# Altium schematic sheet Sheet1.SchDoc
size 420 x 297 mm; SheetNumber: 1; SheetTotal: 1
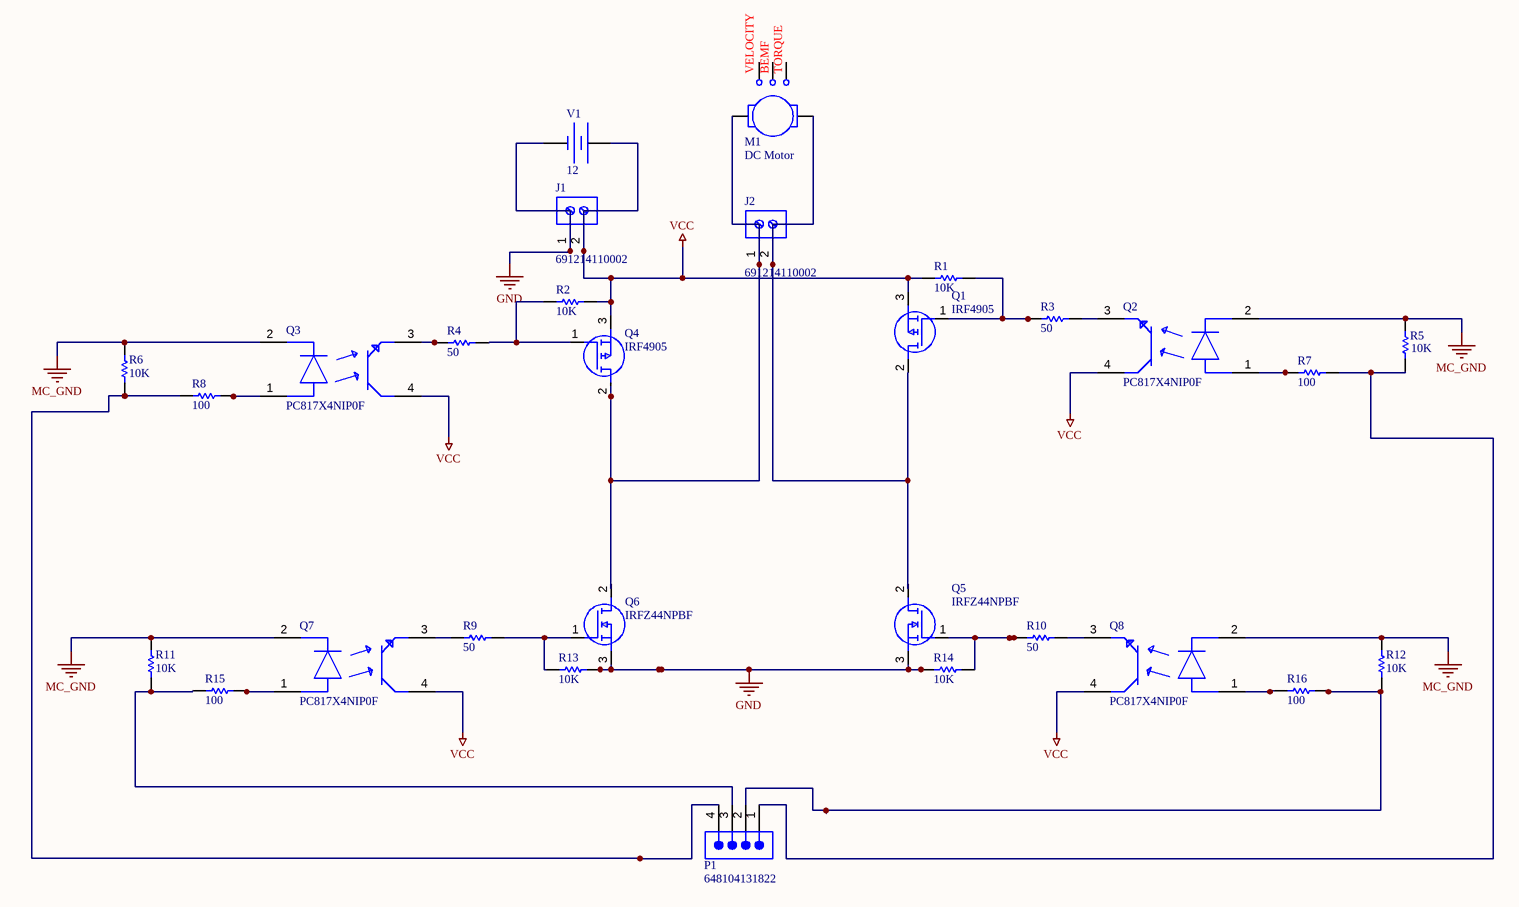
[diagram p0: Sheet1.SchDoc]

## Parts
J1  691214110002  [691214110002]
J2  691214110002  [691214110002]
M1  DC Motor
P1  648104131822  [648104131822]
Q1  IRF4905  [IRF4905_Footprint]
Q2  PC817X4NIP0F  [FP-PC817X4NIP0F-MFG]
Q3  PC817X4NIP0F  [FP-PC817X4NIP0F-MFG]
Q4  IRF4905  [IRF4905_Footprint]
Q5  IRFZ44NPBF  [IRFZ44NPBF_FOOTPRINT]
Q6  IRFZ44NPBF  [IRFZ44NPBF_FOOTPRINT]
Q7  PC817X4NIP0F  [FP-PC817X4NIP0F-MFG]
Q8  PC817X4NIP0F  [FP-PC817X4NIP0F-MFG]
R1  10K  [RESC3216X70X50NL05T20]
R2  10K  [RESC3216X70X50NL05T20]
R3  50  [RESC3216X70X50NL05T20]
R4  50  [RESC3216X70X50NL05T20]
R5  10K  [RESC3216X70X50NL05T20]
R6  10K  [RESC3216X70X50NL05T20]
R7  100  [RESC3216X70X50NL05T20]
R8  100  [RESC3216X70X50NL05T20]
R9  50  [RESC3216X70X50NL05T20]
R10  50  [RESC3216X70X50NL05T20]
R11  10K  [RESC3216X70X50NL05T20]
R12  10K  [RESC3216X70X50NL05T20]
R13  10K  [RESC3216X70X50NL05T20]
R14  10K  [RESC3216X70X50NL05T20]
R15  100  [RESC3216X70X50NL05T20]
R16  100  [RESC3216X70X50NL05T20]
V1  DC Magnitude: 12  (hidden comment: Constant Voltage Source)

## Nets
GND: J1.1 Q5.3(S) Q6.3(S) R13.1 R14.2 V1.2
MC_GND: Q2.2(C) Q3.2(C) Q7.2(C) Q8.2(C) R5.2 R6.2 R11.2 R12.2
VCC: J1.2 Q1.3(S) Q2.4(C) Q3.4(C) Q4.3(S) Q7.4(C) Q8.4(C) R1.2 R2.1 V1.1
NetJ2_1: J2.1 M1.1 Q4.2(D) Q6.2(D)
NetJ2_2: J2.2 M1.2 Q1.2(D) Q5.2(D)
NetP1_1: P1.1 R5.1 R7.2
NetP1_2: P1.2 R12.1 R16.2
NetP1_3: P1.3 R11.1 R15.1
NetP1_4: P1.4 R6.1 R8.1
NetQ1_1: Q1.1(G) R1.1 R3.1
NetQ2_1: Q2.1(A) R7.1
NetQ2_3: Q2.3(E) R3.2
NetQ3_1: Q3.1(A) R8.2
NetQ3_3: Q3.3(E) R4.1
NetQ4_1: Q4.1(G) R2.2 R4.2
NetQ5_1: Q5.1(G) R10.1 R14.1
NetQ6_1: Q6.1(G) R9.2 R13.2
NetQ7_1: Q7.1(A) R15.2
NetQ7_3: Q7.3(E) R9.1
NetQ8_1: Q8.1(A) R16.1
NetQ8_3: Q8.3(E) R10.2

Not connected (* = marked no-connect by the designer): M1 3 4 5

## Notes on the sheet
- THIS DOCUMENT AND THE DATA DISCLOSED HEREIN OR
- HEREWITH IS THE PROPERTY OF ALTIUM LIMITED AND MAY
- DWG NO:
- REVISION
- REV:
- DESCRIPTION
- DATE
- APPROVED
- BE FREELY DISTRIBUTED IN WHOLE. NO RIGHTS ARE
- RESERVED OR EXPRESS OR IMPLIED WARANTEE GIVEN.
- ENG:
- APPROVALS
- PROJECT
- DSN:
- CHK:
- REFERENCE DOCUMENTS
- PROJECT REVISION:
- TITLE
- DOCUMENT REVISION:
- DESIGN ITEM:
- BOM:
- FAB DWG:
- PCB DWG:
- ASSY DWG:
- SCALE:
- A3
- SIZE
- CAGE CODE
- FILE NAME
- DWG NO.
- SHEET
- OF
- REV
- (in symbol DC Motor) VELOCITY; BEMF; TORQUE

## Library data of the parts
J1 J2 = CMP-1502-02464-2: NexarPartId: 18818288; Plating: Brass, Steel; Current: 10A; Pitch: 3.5052mm; Number of Levels: 1; Number of Contacts: 2; Wire Gauge (Min): 16AWG; Voltage: 300V; Wire Gauge (Max): 24AWG; Stripping Length: -6mm; Number of Pins: 2; Number of Rows: 1; REACH SVHC: Unknown; RoHS: Compliant; Housing Material: Nylon; Termination: Screw; Mount: Through Hole; Contact Plating: Brass, Tin; Number of Positions Per Level: 2; Color: Blue, Green; Width: 7.9mm; Voltage Rating: 300V; Length: 7.4mm; Current Rating: 10A; Wire/Cable Gauge: 24AWG; Packaging: Box; Max Operating Temperature: 105°C; Lead Pitch: 3.5mm; Height: 8.7mm; Contact Material: Brass; Min Operating Temperature: -40°C
M1 = DC Motor: LA: 1.5M; RA: 0.5; KE: 0.05; JM: 250U; BM: 0.1M; TL: 0; SimulationGenericComponent: True; KT: 0.05
P1 = CMP-1502-00732-2: NexarPartId: 18818253; Gender: Male; Current Rating: 1A; Connector Type: Male Pin; Voltage Rating: 50V; Contact Resistance: 20mΩ; Pitch: 1.5mm; Number of Contacts: 4; Insulation Resistance: 500MΩ; Insulation: Insulated; Min Operating Temperature: -25°C; Max Operating Temperature: 85°C; Contact Plating: Tin; Lead Pitch: 1.5mm; Length: 9mm; Termination: SMD/SMT; Height: 3.7mm; Housing Material: Nylon; Contact Material: Copper; Contact Gender: Male; REACH SVHC: Unknown; Flammability Rating: UL94 V-0; Color: Beige, White; Operating Supply Voltage: 50V; Number of Rows: 1; Width: 9mm; RoHS: Compliant; Number of Pins: 4; Mount: Surface Mount; Number of Positions: 4; Packaging: Tape and Reel
Q1 Q4 = IRF4905: MOSFET Transistor, P-Channel, TO-220AB; Manufacturer_Name: Infineon; Geometry.Height: 4.69mm; Manufacturer_Part_Number: IRF4905; Mouser Part Number: N/A; Mouser Price/Stock: https://www.mouser.co.uk/ProductDetail/Infineon-IR/IRF4905?qs=zO0nedAqnNIhlaIbSqqpvQ%3D%3D; Arrow Part Number: IRF4905; Arrow Price/Stock: https://www.arrow.com/en/products/irf4905/international-rectifier?region=nac; Datasheet Link: https://www.infineon.com/dgdl/irf4905pbf.pdf?fileId=5546d462533600a4015355e329b1197e
Q2 Q3 Q7 Q8 = CMP-65434-000001-1: OPTOISOLATOR 5KV TRANS 4SMD; Manufacturer: Sharp; Collector Emitter Voltage: 80V; Standoff Height: 0.1mm; Power Dissipation: 200mW; Min Current Transfer Ratio: 50%; Description: Optocoupler DC-IN 1-CH Transistor DC-OUT 4-Pin PDIP SMD; Reverse Voltage: 6V; Forward Current: 20mA; Forward Voltage: 1.2V; Max Current Transfer Ratio: 600%; Isolation Voltage: 5kVrms; Mouser Description: Transistor Output Optocouplers Photocoupler 300-600% CRT; RoHS: TRUE; ComponentLink2URL: https://www.sharpsde.com/fileadmin/products/Optoelectronics/Isolation%20Devices/Specs%20Photocoupler/PC817XxNIP0F_17Jun08_Spec_ED-04P129A.pdf; Lead Free: Yes; Device Class L1: Optoelectronics; ComponentLink2Description: Datasheet; Device Class L2: Optocouplers; Temperature: -30°C to +100°C; Temperature Range Low: -30°C; Automotive: No; Temperature Range High: +100°C; Octopart: https://octopart.com/pc817x4nip0f-sharp-20650453; Height: 4.6mm; Digikey Description: OPTOISOLATOR 5KV TRANS 4SMD; Category: Trans; Device Class L3: unset; Package: PC817X4NIP0F; Manufacturer Part Number: PC817X4NIP0F; Emiiter Collector Voltage: 6V
Q5 Q6 = IRFZ44NPBF: MOSFET N-Channel 55V 49A TO220AB Infineon IRFZ44NPBF N-channel MOSFET Transistor, 49 A, 55 V, 3-Pin TO-220AB; Geometry.Height: 4.83mm; Manufacturer_Name: Infineon; Manufacturer_Part_Number: IRFZ44NPBF; Mouser Part Number: 942-IRFZ44NPBF; Mouser Price/Stock: https://www.mouser.co.uk/ProductDetail/Infineon-Technologies/IRFZ44NPBF?qs=9%252BKlkBgLFf24zghzPg2f9g%3D%3D; Arrow Part Number: IRFZ44NPBF; Arrow Price/Stock: https://www.arrow.com/en/products/irfz44npbf/infineon-technologies-ag?region=europe; Datasheet Link: https://www.infineon.com/dgdl/irfz44npbf.pdf?fileId=5546d462533600a40153563b3a9f220d
R1-R16 = CMP-2003-00541-1: Manufacturer: Panasonic; Part Number: ERJ-8GEY0R00V
V1 = Battery: SimulationGenericComponent: True